# Altium schematic sheet 01_MAIN.SchDoc: =GlobalProjectName
size 594 x 420 mm; CheckedBy: A_D; Author: A_D; SheetTotal: 1; PageSetup: Record=PageOptions|CenterHorizontal=True|CenterVertical=True|PrintScale=0.70|XCorrection=1.00|YCorrection=1.00|PrintKind=2|BorderSize=5000000|LeftOffset=9000|BottomOffset=10100|Orientation=2|PaperLength=11176|PaperWidth=8636|Scale=100|PaperSource=259|PrintQuality=-3|MediaType=1|DitherType=10|PrintScaleMode=1|PaperKind=A3|PaperIndex=8
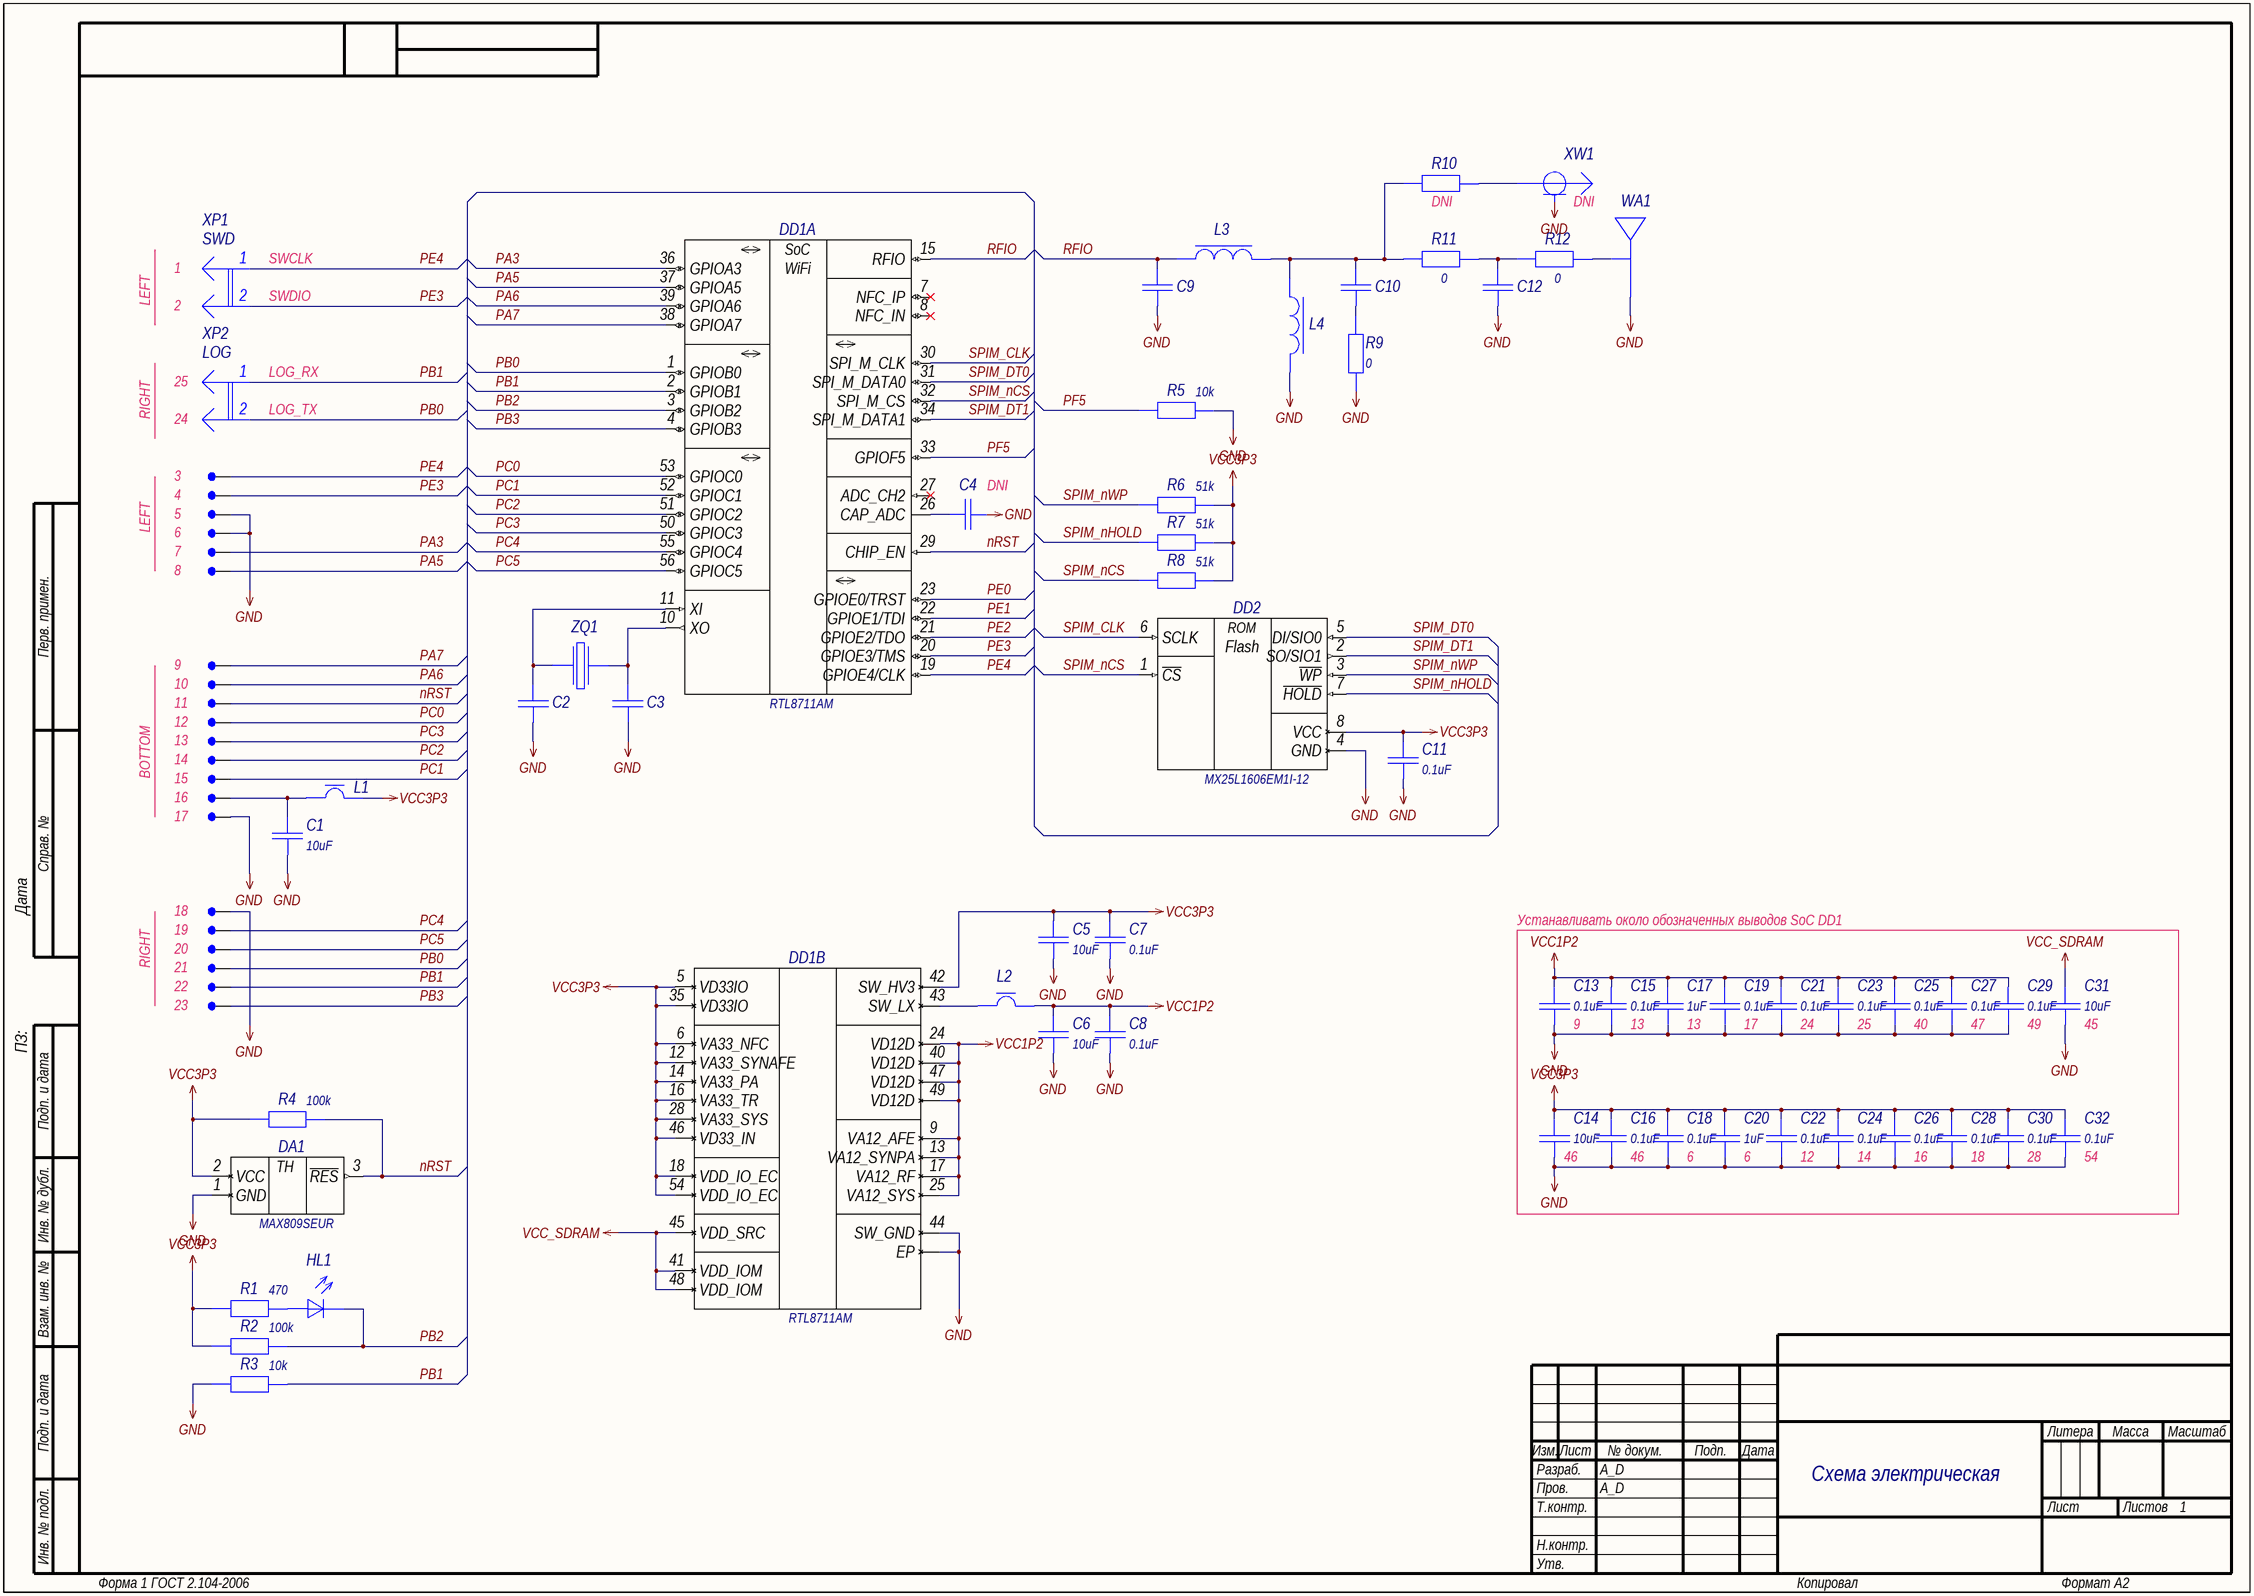
[diagram p0: 01_MAIN.SchDoc]

## Parts
C1  value 10uF  [C0603_L]  (hidden comment: Capacitor)
C2  Capacitor  [C0402_L]  (value not drawn)
C3  Capacitor  [C0402_L]  (value not drawn)
C4  Capacitor  [C0603_L]  (value not drawn)  (no BOM)
C5  value 10uF  [C0603_L]  (hidden comment: Capacitor)
C6  value 10uF  [C0603_L]  (hidden comment: Capacitor)
C7  value 0.1uF  [C0402_L]  (hidden comment: Capacitor)
C8  value 0.1uF  [C0402_L]  (hidden comment: Capacitor)
C9  Capacitor  [C0402_L]  (value not drawn)
C10  Capacitor  [C0402_L]  (value not drawn)
C11  value 0.1uF  [C0402_L]  (hidden comment: Capacitor)
C12  Capacitor  [C0402_L]  (value not drawn)
C13  value 0.1uF  [C0402_L]  (hidden comment: Capacitor)
C14  value 10uF  [C0603_L]  (hidden comment: Capacitor)
C15  value 0.1uF  [C0402_L]  (hidden comment: Capacitor)
C16  value 0.1uF  [C0402_L]  (hidden comment: Capacitor)
C17  value 1uF  [C0402_L]  (hidden comment: Capacitor)
C18  value 0.1uF  [C0402_L]  (hidden comment: Capacitor)
C19  value 0.1uF  [C0402_L]  (hidden comment: Capacitor)
C20  value 1uF  [C0402_L]  (hidden comment: Capacitor)
C21  value 0.1uF  [C0402_L]  (hidden comment: Capacitor)
C22  value 0.1uF  [C0402_L]  (hidden comment: Capacitor)
C23  value 0.1uF  [C0402_L]  (hidden comment: Capacitor)
C24  value 0.1uF  [C0402_L]  (hidden comment: Capacitor)
C25  value 0.1uF  [C0402_L]  (hidden comment: Capacitor)
C26  value 0.1uF  [C0402_L]  (hidden comment: Capacitor)
C27  value 0.1uF  [C0402_L]  (hidden comment: Capacitor)
C28  value 0.1uF  [C0402_L]  (hidden comment: Capacitor)
C29  value 0.1uF  [C0402_L]  (hidden comment: Capacitor)
C30  value 0.1uF  [C0402_L]  (hidden comment: Capacitor)
C31  value 10uF  [C0603_L]  (hidden comment: Capacitor)
C32  value 0.1uF  [C0402_L]  (hidden comment: Capacitor)
DA1  value MAX809SEUR  [SOT-23]  (hidden comment: MAX809-Series)
DD1  RTL8711AM  [QFN-56-7x7]  (parts A,B of 2)
DD2  value MX25L1606EM1I-12  [SOIC-8]  (hidden comment: MX25L1606E-8Pin-Series)
HL1  Text  [LD0603_L]  (value not drawn)
L1  FerriteBead  [L0603_L]  (value not drawn)
L2  FerriteBead  [L0805_L]  (value not drawn)
L3  Coil  [L0402_L]  (value not drawn)
L4  Coil  [L0402_L]  (value not drawn)
R1  value 470  [R0402_L]  (hidden comment: Resistor)
R2  value 100k  [R0402_L]  (hidden comment: Resistor)
R3  value 10k  [R0402_L]  (hidden comment: Resistor)
R4  value 100k  [R0402_L]  (hidden comment: Resistor)
R5  value 10k  [R0402_L]  (hidden comment: Resistor)
R6  value 51k  [R0402_L]  (hidden comment: Resistor)
R7  value 51k  [R0402_L]  (hidden comment: Resistor)
R8  value 51k  [R0402_L]  (hidden comment: Resistor)
R9  value 0  [R0402_L]  (hidden comment: Resistor)
R10  Resistor  [R0402_L]  (value not drawn)  (no BOM)
R11  value 0  [R0402_L]  (hidden comment: Resistor)
R12  value 0  [R0402_L]  (hidden comment: Resistor)
WA1  Antenna_PCB_2p  [PCB-AN043]  (value not drawn)  (net tie, no BOM)
XP1  SWD  [PLS-2]
XP2  LOG  [PLS-2]
XS1  PCB-SPIN  [PCB-SPIN]  (value not drawn)  (no BOM)
XS2  PCB-SPIN  [PCB-SPIN]  (value not drawn)  (no BOM)
XS3  PCB-SPIN  [PCB-SPIN]  (value not drawn)  (no BOM)
XS4  PCB-SPIN  [PCB-SPIN]  (value not drawn)  (no BOM)
XS5  PCB-SPIN  [PCB-SPIN]  (value not drawn)  (no BOM)
XS6  PCB-SPIN  [PCB-SPIN]  (value not drawn)  (no BOM)
XS7  PCB-SPIN  [PCB-SPIN]  (value not drawn)  (no BOM)
XS8  PCB-SPIN  [PCB-SPIN]  (value not drawn)  (no BOM)
XS9  PCB-SPIN  [PCB-SPIN]  (value not drawn)  (no BOM)
XS10  PCB-SPIN  [PCB-SPIN]  (value not drawn)  (no BOM)
XS11  PCB-SPIN  [PCB-SPIN]  (value not drawn)  (no BOM)
XS12  PCB-SPIN  [PCB-SPIN]  (value not drawn)  (no BOM)
XS13  PCB-SPIN  [PCB-SPIN]  (value not drawn)  (no BOM)
XS14  PCB-SPIN  [PCB-SPIN]  (value not drawn)  (no BOM)
XS15  PCB-SPIN  [PCB-SPIN]  (value not drawn)  (no BOM)
XS16  PCB-SPIN  [PCB-SPIN]  (value not drawn)  (no BOM)
XS17  PCB-SPIN  [PCB-SPIN]  (value not drawn)  (no BOM)
XS18  PCB-SPIN  [PCB-SPIN]  (value not drawn)  (no BOM)
XS19  PCB-SPIN  [PCB-SPIN]  (value not drawn)  (no BOM)
XS20  PCB-SPIN  [PCB-SPIN]  (value not drawn)  (no BOM)
XS21  PCB-SPIN  [PCB-SPIN]  (value not drawn)  (no BOM)
XW1  Con-RF-M  [1909763-1]  (value not drawn)  (no BOM)
ZQ1  Crystal  [SX-2520]  (value not drawn)

## Nets
GND: C1.1 C2.1 C3.1 C4.1 C5.1 C6.1 C7.1 C8.1 C9.1 C11.1 C12.1 C13.1 C14.1 C15.1 C16.1 C17.1 C18.1 C19.1 C20.1 C21.1 C22.1 C23.1 C24.1 C25.1 C26.1 C27.1 C28.1 C29.1 C30.1 C31.1 C32.1 DA1.1(GND) DD1.44(SW_GND) DD1.57(EP) DD2.4(GND) L4.2 R3.1 R5.2 R9.1 WA1.2 XS3.1 XS4.1 XS15.1 XS16.1 XW1.2
VCC1P2: C6.2 C8.2 C13.2 C15.2 C17.2 C19.2 C21.2 C23.2 C25.2 C27.2 C29.2 DD1.9(VA12_AFE) DD1.13(VA12_SYNPA) DD1.17(VA12_RF) DD1.24(VD12D) DD1.25(VA12_SYS) DD1.40(VD12D) DD1.47(VD12D) DD1.49(VD12D) L2.2
VCC3P3: C5.2 C7.2 C11.2 C14.2 C16.2 C18.2 C20.2 C22.2 C24.2 C26.2 C28.2 C30.2 C32.2 DA1.2(VCC) DD1.5(VD33IO) DD1.6(VA33_NFC) DD1.12(VA33_SYNAFE) DD1.14(VA33_PA) DD1.16(VA33_TR) DD1.18(VDD_IO_EC) DD1.28(VA33_SYS) DD1.35(VD33IO) DD1.42(SW_HV3) DD1.46(VD33_IN) DD1.54(VDD_IO_EC) DD2.8(VCC) L1.2 R1.1 R2.1 R4.1 R6.1 R7.1 R8.1
VCC_SDRAM: C31.2 DD1.41(VDD_IOM) DD1.45(VDD_SRC) DD1.48(VDD_IOM)
nRST: DA1.3(~{RES}) DD1.29(CHIP_EN) R4.2 XS9.1
PA3: DD1.36(GPIOA3) XS5.1
PA5: DD1.37(GPIOA5) XS6.1
PA6: DD1.39(GPIOA6) XS8.1
PA7: DD1.38(GPIOA7) XS7.1
PB0: DD1.1(GPIOB0) XP2.2 XS19.1
PB1: DD1.2(GPIOB1) R3.2 XP2.1 XS20.1
PB2: DD1.3(GPIOB2) HL1.2(К) R2.2
PB3: DD1.4(GPIOB3) XS21.1
PC0: DD1.53(GPIOC0) XS10.1
PC1: DD1.52(GPIOC1) XS13.1
PC2: DD1.51(GPIOC2) XS12.1
PC3: DD1.50(GPIOC3) XS11.1
PC4: DD1.55(GPIOC4) XS17.1
PC5: DD1.56(GPIOC5) XS18.1
PE0: DD1.23(GPIOE0/TRST)
PE1: DD1.22(GPIOE1/TDI)
PE2: DD1.21(GPIOE2/TDO)
PE3: DD1.20(GPIOE3/TMS) XP1.2 XS2.1
PE4: DD1.19(GPIOE4/CLK) XP1.1 XS1.1
PF5: DD1.33(GPIOF5) R5.1
RFIO: C9.2 DD1.15(RFIO) L3.1
SPIM_CLK: DD1.30(SPI_M_CLK) DD2.6(SCLK)
SPIM_DT0: DD1.31(SPI_M_DATA0) DD2.5(DI/SIO0)
SPIM_DT1: DD1.34(SPI_M_DATA1) DD2.2(SO/SIO1)
SPIM_nCS: DD1.32(SPI_M_CS) DD2.1(~{CS}) R8.2
SPIM_nHOLD: DD2.7(~{HOLD}) R7.2
SPIM_nWP: DD2.3(~{WP}) R6.2
NetC1_2: C1.2 L1.1 XS14.1
NetC2_2: C2.2 DD1.11(XI) ZQ1.1
NetC3_2: C3.2 DD1.10(XO) ZQ1.3
NetC4_2: C4.2 DD1.26(CAP_ADC)
NetC10_1: C10.1 R9.2
NetC10_2: C10.2 L3.2 L4.1 R10.2 R11.2
NetC12_2: C12.2 R11.1 R12.2
NetDD1_43: DD1.43(SW_LX) L2.1
NetHL1_1: HL1.1(А) R1.2
NetR10_1: R10.1 XW1.1
NetR12_1: R12.1 WA1.1

Not connected (* = marked no-connect by the designer): DD1 7(NFC_IP)* 8(NFC_IN)* 27(ADC_CH2)*

## Notes on the sheet
- (near R10) DNI
- (near XW1) DNI
- (near XP1) SWCLK
- LEFT
- 1
- 2
- (near XP1) SWDIO
- 25
- (near XP2) LOG_RX
- RIGHT
- 24
- (near XP2) LOG_TX
- 3
- 4
- (near C4) DNI
- 5
- 6
- 7
- 8
- 9
- 10
- 11
- 12
- 13
- BOTTOM
- 14
- 15
- 16
- 17
- 18
- 19
- Устанавливать около обозначенных выводов SoC DD1
- 20
- 21
- 22
- 23
- 40
- 47
- 49
- (near C31) 45
- (near C14) 46
- 46
- 28
- (near C32) 54
- Схема электрическая
  принципиальная
- Перв. примен.
- Справ. №
- ПЗ:                             Дата
- Подп. и дата
- Инв. № дубл.
- Взам. инв. №
- Разраб.
- Изм.
- Лист
- № докум.
- Подп.
- Дата
- Литера
- Масса
- Масштаб
- Пров.
- Т.контр.
- Листов
- Инв. № подл.
- Н.контр.
- Утв.
- Форма 1 ГОСТ 2.104-2006
- Копировал
- Формат А2
- (in symbol MAX809SEUR) TH
- (in symbol MX25L1606EM1I-12) ROM; Flash
- (in symbol RTL8711AM, part A) SoC; WiFi

## Library data of the parts
C1 C5 C6 C14 C31 = GRM188R60J106ME47D: Manufacturer: Murata; Type: Конденсатор; ID: 136; Voltage: 6.3V; Tolerance: ±20%; Dielectric Type: X5R; Application Category: 1; Working Temperature Min: -55°С; Working Temperature Max: +85°С; Published: 18.05.2010; Publisher: Andrew Danich; Part Number: GRM188R60J106ME47D; Footprint: 0603
C2 C3 = GRM1555C1H120JA01D: Manufacturer: Murata; Type: Конденсатор; ID: 159; Value: 12pF; Voltage: 50V; Tolerance: ±5%; Dielectric Type: NP0; Published: 18.05.2010; Publisher: Andrew Danich; Part Number: GRM1555C1H120JA01D; Footprint: 0402
C4 = GRM188R60J106ME47D: Manufacturer: Murata; Type: Конденсатор; ID: 136; Value: 10uF; Voltage: 6.3V; Tolerance: ±20%; Dielectric Type: X5R; Application Category: 1; Working Temperature Min: -55°С; Working Temperature Max: +85°С; Published: 18.05.2010; Publisher: Andrew Danich; Part Number: GRM188R60J106ME47D; Footprint: 0603
C7 C8 C11 C13 C15 C16 C18 C19 C21-C30 C32 = GRM155R71A104KA01D: Manufacturer: Murata; Type: Конденсатор; ID: 151; Voltage: 10V; Tolerance: ±10%; Dielectric Type: X7R; Published: 18.05.2010; Publisher: Andrew Danich; Part Number: GRM155R71A104KA01D; Footprint: 0402
C9 C10 C12 = GRM1555C1E2R7BA01D: Manufacturer: Murata; Type: Конденсатор; ID: 198; Value: 2.7pF; Voltage: 50V; Tolerance: ±0.1pF; Dielectric Type: NP0; Application Category: 1; Working Temperature Min: -55°С; Working Temperature Max: +125°С; Published: 18.05.2010; Publisher: Andrew Danich; Part Number: GRM1555C1E2R7BA01D; Footprint: 0402
C17 C20 = GRM155R61A105KE15D: Manufacturer: Murata; Type: Конденсатор; ID: 179; Voltage: 10V; Tolerance: ±10%; Dielectric Type: X5R; Application Category: 1; Working Temperature Min: -55°С; Working Temperature Max: +125°С; Published: 18.05.2010; Publisher: Andrew Danich; Part Number: GRM155R61A105KE15D; Footprint: 0402
DA1 = MAX809SEUR: Manufacturer: Maxim Integrated; ID: 2; Supply Voltage: +1.2…5.5V; Supply Current: 17uA; Reset Threshold: +2.93V; Temperature Coefficient: 30ppm; Reset Delay: 20uS; Manual Reset Input: 1; Output Type: Push-Pull; Working Temperature Min: -40°С; Working Temperature Max: +105°С; Published: 24.01.2018; Publisher: Andrew Danich; Type: Микросхема; Part Number: MAX809SEUR; Application Category: 1
DD1 = RTL8711AM: Manufacturer: Realtek; ID: 6; Supply Operation: +3.0…3.6V; Supply Current: 150mA; Flash: External; Wireless Compatibility: WiFi 802.11 b/g/n, 802.11e; Supported Interfaces: SDIO, I2C, I2S, PCM, SPI, UART, ADC, NFC; I/O Lines: 19; Operation Frequency: 166MHz; Application Category: 1; Working Temperature Min: -20°С; Working Temperature Max: +85°С; Published: 01.08.2017; Publisher: Andrew Danich; Type: Микросхема; Part Number: RTL8711AM; Value: RTL8711AM; Functional Analog: -
DD2 = MX25L1606EM1I-12: Manufacturer: MXIC; ID: 11; Supply Operation: +2.7…3.6V; Supply Current: 25mA; Memory: 16Mbit/2Mbyte; Addressable: NO; Interface: SPI, Dual SPI; Clock Frequency: 86MHz; Application Category: 1; Working Temperature Min: -40°С; Working Temperature Max: +85°С; Published: 11.06.2017; Type: Микросхема; Publisher: Andrew Danich; Part Number: MX25L1606EM1I-12
HL1 = BL-LS0603GC: Type: Индикатор единичный; ID: 14; Forward Voltage: 2.3V; Forward Current: 30mA; Power Dissipation: 65mW; Color: Green; Leds: 1; Published: 03.12.2013; Publisher: Andrew Danich; Part Number: BL-LS0603GC; Value: BL-LS0603GC; Footprint: 0603
L1 = BLM18PG121SN1: Manufacturer: Murata; Type: Дроссель; ID: 4; Rated Current: 2A; Impedance at 100Mhz: 120ohm; DC Resistance: 0.05ohm; Inductor Type: EMIFIL; Application Category: 1; Working Temperature Min: -55°С; Working Temperature Max: +125°С; Published: 14.11.2014; Publisher: Andrew Danich; Part Number: BLM18PG121SN1; Value: BLM18PG121SN1; Footprint: 0603
L2 = BLM21PG331SN1: Manufacturer: Murata; Type: Дроссель; ID: 2; Rated Current: 1.5A; Impedance at 100Mhz: 330ohm; DC Resistance: 0.07ohm; Inductor Type: EMIFIL; Application Category: 1; Working Temperature Min: -55°С; Working Temperature Max: +125°С; Published: 14.11.2014; Publisher: Andrew Danich; Part Number: BLM21PG331SN1; Value: BLM21PG331SN1; Footprint: 0805
L3 L4 = LQG15HS2N2S02D: Manufacturer: Murata; Type: Дроссель; ID: 84; Rated Current: 300mA; Tolerance: ±0.3nH; Inductance: 2.2nH; Application Category: 1; Published: 20.05.2010; Publisher: Andrew Danich; Part Number: LQG15HS2N2S02D; Value: LQG15HS2N2S02D; Footprint: 0402
R1 = RC0402JR-07430RL: Manufacturer: Yageo; ID: 376; Limit Voltage: 50V; Tolerance: ±5%; Temperature Coefficient: 100ppm; Total Power Dissipation: 0.1W; Series Type: Thick-Film; Application Category: 1; Working Temperature Min: -55°С; Working Temperature Max: +155°С; Published: 24.03.2010; Publisher: Andrew Danich; Type: Резистор; Part Number: RC0402JR-07430RL; Footprint: 0402
R2 R4 = RC0402JR-07100KL: Manufacturer: Yageo; ID: 351; Limit Voltage: 50V; Tolerance: ±5%; Temperature Coefficient: 100ppm; Total Power Dissipation: 0.1W; Series Type: Thick-Film; Application Category: 1; Working Temperature Min: -55°С; Working Temperature Max: +155°С; Published: 24.03.2010; Publisher: Andrew Danich; Type: Резистор; Part Number: RC0402JR-07100KL; Footprint: 0402
R3 R5 = RC0402FR-0710KL: Manufacturer: Yageo; ID: 2; Limit Voltage: 50V; Tolerance: ±1%; Temperature Coefficient: 100ppm; Total Power Dissipation: 0.1W; Series Type: Thick-Film; Application Category: 1; Working Temperature Min: -55°С; Working Temperature Max: +155°С; Published: 24.03.2010; Publisher: Andrew Danich; Type: Резистор; Part Number: RC0402FR-0710KL; Footprint: 0402
R6-R8 = RC0402JR-0751KL: Manufacturer: Yageo; ID: 388; Limit Voltage: 50V; Tolerance: ±5%; Temperature Coefficient: 100ppm; Total Power Dissipation: 0.1W; Series Type: Thick-Film; Application Category: 1; Working Temperature Min: -55°С; Working Temperature Max: +155°С; Published: 24.03.2010; Publisher: Andrew Danich; Type: Резистор; Part Number: RC0402JR-0751KL; Footprint: 0402
R9 R11 R12 = RC0402JR-070RL: Manufacturer: Yageo; ID: 362; Limit Voltage: 50V; Tolerance: ±1%; Temperature Coefficient: 100ppm; Total Power Dissipation: 0.1W; Series Type: Thick-Film; Application Category: 1; Working Temperature Min: -55°С; Working Temperature Max: +155°С; Published: 24.03.2010; Publisher: Andrew Danich; Type: Резистор; Part Number: RC0402JR-070RL; Footprint: 0402
R10 = RC0402JR-070RL: Manufacturer: Yageo; ID: 362; Value: 0; Limit Voltage: 50V; Tolerance: ±1%; Temperature Coefficient: 100ppm; Total Power Dissipation: 0.1W; Series Type: Thick-Film; Application Category: 1; Working Temperature Min: -55°С; Working Temperature Max: +155°С; Published: 24.03.2010; Publisher: Andrew Danich; Type: Резистор; Part Number: RC0402JR-070RL; Footprint: 0402
WA1 = PCB-AN043: Manufacturer: Texas Instruments; ID: 2; Center Frequency: 2.45GHz; Input Impedance: 50ohm; Application Category: 1; Published: 08.01.2017; Type: Антенна; Publisher: Andrew Danich; Part Number: PCB-AN043; Value: PCB-AN043; Functional Analog: -
XP1 XP2 = PLS-2: Value: PLS-2; ID: 1; Limit Voltage: 250V; Limit Current: 3A; Connector Type: Male; Resistance: 15momh; Surface Finish: Gold; Pitch: 2.54mm; Published: 07.03.2013; Publisher: Andrew Danich; Type: Вилка; Part Number: PLS-2; Pins: 2
XW1 = 1909763-1: Manufacturer: TE Connectivity; ID: 3; Connector Type: Male; Wave Resistance: 50ohm; Surface Finish: Gold; Frequency Band: 6GHz; Application Category: 1; Working Temperature Min: -40°С; Working Temperature Max: +90°С; Published: 19.09.2015; Publisher: НТЦ "Вектор"; Type: Вилка; Part Number: 1909763-1; Value: 1909763-1; Limit Voltage: -; Limit Current: -; Pins: 3
ZQ1 = CX2520DB40000D0FLJCC: Manufacturer: AVX / Kyocera; ID: 24; Output Frequency: 40MHz; Load Capacitance: 8pF; Temperature Coefficient: ±15ppm; Drive Level: 10uW; Application Category: 1; Working Temperature Min: -30°С; Working Temperature Max: +85°С; Published: 08.03.2013; Publisher: Andrew Danich; Type: Резонатор; Part Number: CX2520DB40000D0FLJCC; Value: CX2520DB40000D0FLJCC